# EasyEDA Pro project ProPrj_ZYNQ7020_V1_2024-12-31.epro, board PCB_7020
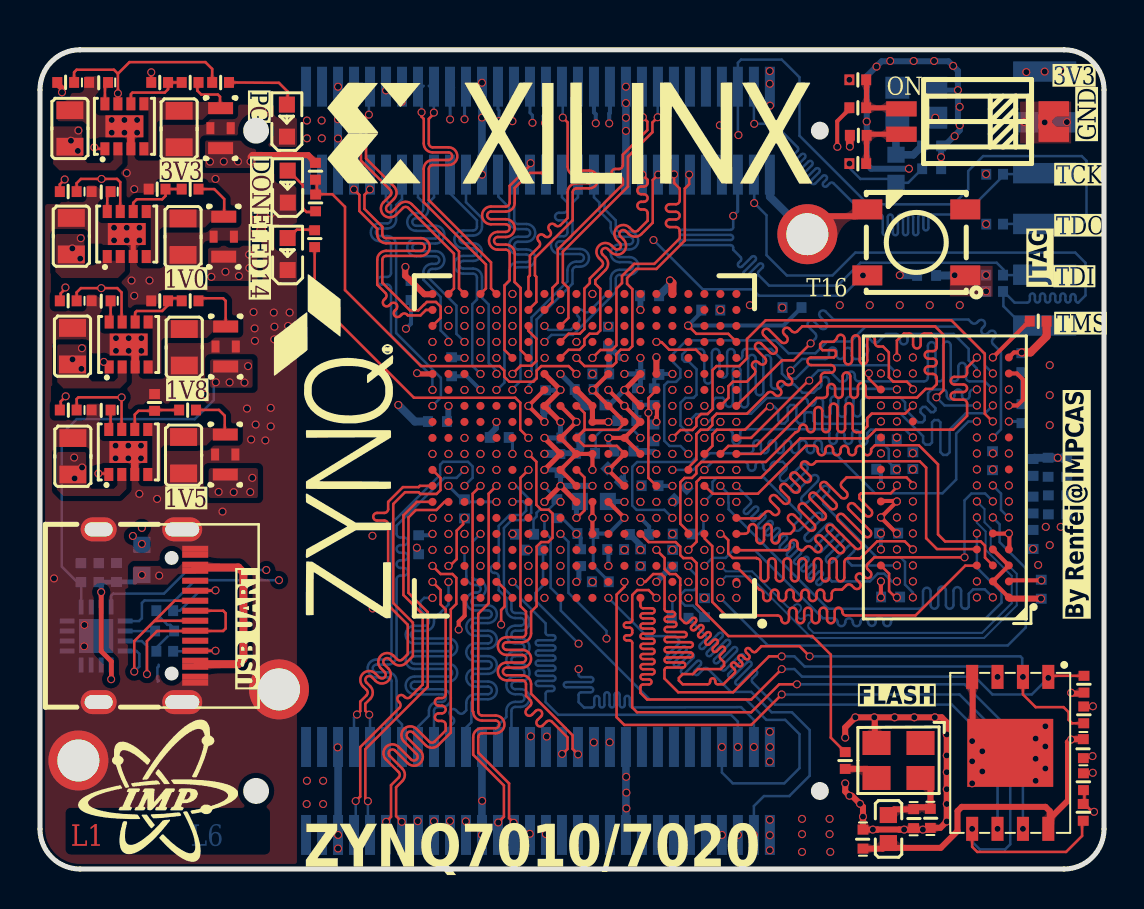
[diagram p5: board, top side]
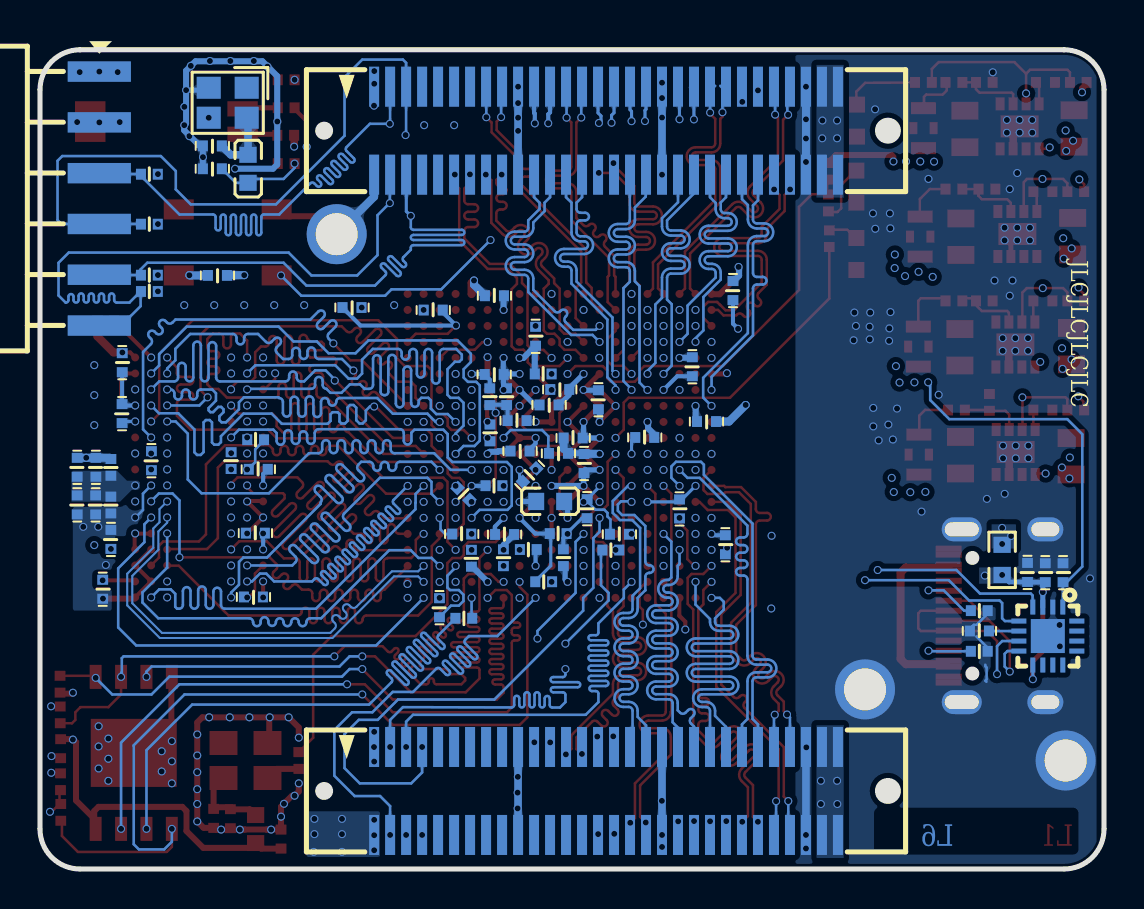
[diagram p6: board, bottom side, seen from below]

Outline 53.22 x 40.97 mm; copper layers: Top Layer, 地1, 电源, 信号, 地2, Bottom Layer. Coordinates in mm from the lower left corner of the outline.
Outline path: 0,38.97 0,2 arc(0.59,0.59) 2,0 51.22,0 arc(52.63,0.59) 53.22,2 53.22,38.97 arc(52.63,40.38) 51.22,40.97 2,40.97 arc(0.59,40.38) 0,38.97
Stack: Top Layer 0.035mm 外层铜厚1oz / Dielectric1 0.0994mm 3313 RC57% 4.2mil / 地1 0.0152mm 内层铜厚 / Dielectric2 0.55mm 0.55mm H/H No copper / 电源 0.0152mm 内层铜厚 / Dielectric3 0.1088mm 2116 RC54% 4.9mil / 信号 0.0152mm 内层铜厚 / Dielectric4 0.55mm 0.55mm H/H No copper / 地2 0.0152mm 内层铜厚 / Dielectric5 0.0994mm 3313 RC57% 4.2mil / Bottom Layer 0.035mm 外层铜厚1oz

## Design rules (mm)
net DDR_DQS0_N: DDR_DQS0_
net DDR_DQS0_P: DDR_DQS0_
net DDR_DQS1_N: DDR_DQS1_
net DDR_DQS1_P: DDR_DQS1_
net DDR_CLK_P: DDR_CLK_
net DDR_CLK_N: DDR_CLK_
net AIO_1_N: AIO_1
net AIO_1_P: AIO_1
net AIO_2_P: AIO_2
net AIO_5_P: AIO_5
net AIO_6_N: AIO_6
net AIO_24_P: AIO_24
net AIO_5_N: AIO_5
net AIO_9_P: AIO_9
net AIO_19_P: AIO_19
net AIO_24_N: AIO_24
net AIO_23_P: AIO_23
net AIO_13_P: AIO_13
net AIO_14_P: AIO_14
net AIO_23_N: AIO_23
net AIO_13_N: AIO_13
net AIO_14_N: AIO_14
net AIO_19_N: AIO_19
net AIO_20_N: AIO_20
net AIO_20_P: AIO_20
net AIO_15_P: AIO_15
net AIO_8_N: AIO_8
net AIO_7_P: AIO_7
net AIO_7_N: AIO_7
net AIO_17_P: DP1
net AIO_17_N: DP1
net AIO_4_N: AIO_4
net AIO_8_P: AIO_8
net AIO_10_N: AIO_10
net AIO_18_N: AIO_18
net AIO_22_P: AIO_22
net AIO_22_N: AIO_22
net AIO_16_N: AIO_16
net AIO_4_P: AIO_4
net AIO_3_N: AIO_3
net AIO_10_P: AIO_10
net AIO_18_P: AIO_18
net AIO_21_P: AIO_21
net AIO_21_N: AIO_21
net AIO_16_P: AIO_16
net AIO_2_N: AIO_2
net AIO_3_P: AIO_3
net AIO_9_N: AIO_9
net AIO_12_P: AIO_12
net AIO_12_N: AIO_12
net AIO_15_N: AIO_15
net AIO_6_P: AIO_6
net BIO_19_N: BIO_19
net BIO_6_P: BIO_6
net BIO_19_P: BIO_19
net BIO_22_N: BIO_22
net BIO_23_N: BIO_23
net BIO_21_P: BIO_21
net BIO_21_N: BIO_21
net BIO_11_P: BIO_11
net BIO_24_P: BIO_24
net BIO_24_N: BIO_24
net BIO_13_P: BIO_13
net BIO_2_N: BIO_2
net BIO_2_P: BIO_2
net BIO_1_N: BIO_1
net BIO_1_P: BIO_1
net BIO_3_N: BIO_3
net BIO_4_P: BIO_4
net BIO_4_N: BIO_4
net BIO_3_P: BIO_3
net BIO_5_P: BIO_5
net BIO_5_N: BIO_5
net BIO_6_N: BIO_6
net BIO_15_P: BIO_15
net BIO_15_N: BIO_15
net BIO_16_P: BIO_16
net BIO_16_N: BIO_16
net BIO_18_P: BIO_18
net BIO_18_N: BIO_18
net BIO_13_N: BIO_13
net BIO_14_N: BIO_14
net BIO_17_N: BIO_17
net BIO_14_P: BIO_14
net BIO_10_N: BIO_10
net BIO_17_P: BIO_17
net BIO_12_P: BIO_12
net BIO_12_N: BIO_12
net BIO_10_P: BIO_10
net BIO_11_N: BIO_11
net BIO_9_P: BIO_9
net BIO_9_N: BIO_9
net BIO_8_P: BIO_8
net BIO_8_N: BIO_8
net BIO_7_P: BIO_7
net BIO_7_N: BIO_7
net BIO_23_P: BIO_23
net BIO_22_P: BIO_22
net BIO_20_P: BIO_20
net BIO_20_N: BIO_20
template: 自定义配置
spacing copperThickness1oz (default): track to track 0.127, other pairs 0.127 to 0.3
spacing copperThickness2oz: track to track 0.203, other pairs 0.152 to 0.3
track width copperThickness1oz (default): min 0.102, default 0.127, max 2.54
track width copperThickness2oz: min 0.203, default 0.254, max 2.54
differential pair differentialPair: width min 0.102, default 0.102, max 2.54; gap min 0.152, default 0.152
differential pair DIFF100 (default): width min 0.102, default 0.102, max 2.54; gap min 0.127, default 0.127
via viaSize (default): diameter min 0.399, default 0.399, max 10; hole min 0.3, default 0.3, max 6.299
net DDR_DQS0_N uses differentialPair
net DDR_DQS0_P uses differentialPair
net DDR_DQS1_N uses differentialPair
net DDR_DQS1_P uses differentialPair
net DDR_CLK_P uses differentialPair
net DDR_CLK_N uses differentialPair
diff pair DDR_DQS0_ uses differentialPair
diff pair DDR_DQS1_ uses differentialPair
diff pair DDR_CLK_ uses differentialPair

## Placement (name value [footprint] x y rotation side)
C1  100nF  [C0402]  29.36 22.42 180 bottom
C2  3.3nF  [C0402]  3.06 33.88 180 top
C3  3.3nF  [C0402]  3.06 28.41 180 top
C5  22uF  [C0805]  1.57 31.63 90 top
C6  22uF  [C0805]  1.63 26.13 90 top
C7  22uF  [C0805]  7.16 31.63 270 top
C8  22uF  [C0805]  7.22 26.11 270 top
C9  3.3nF  [C0402]  2.94 39.34 180 top
C10  3.3nF  [C0402]  3.06 22.95 180 top
C11  22uF  [C0805]  1.5 37.02 90 top
C12  22uF  [C0805]  1.64 20.63 90 top
C13  22uF  [C0805]  6.96 37.02 270 top
C14  22uF  [C0805]  7.18 20.71 270 top
C15  100nF  [C0402]  33.24 13.06 90 bottom
C16  100nF  [C0402]  47.65 20.41 90 bottom
C17  100nF  [C0402]  37.61 28.08 0 bottom
C18  100nF  [C0402]  42.45 16.8 180 bottom
C19  100nF  [C0402]  32.13 16.75 180 bottom
C20  100nF  [C0402]  49.11 22.77 90 bottom
C21  100nF  [C0402]  50.08 14 270 bottom
C22  100nF  [C0402]  42.31 19.99 180 bottom
C23  100nF  [C0402]  30.5 24.73 0 bottom
C24  100nF  [C0402]  49.11 25.33 270 bottom
C25  100nF  [C0402]  49.67 16.48 90 bottom
C26  100nF  [C0402]  42.54 13.6 0 bottom
C30  100nF  [C0402]  33.56 27.95 180 bottom
C36  100nF  [C0402]  50.44 18.2 90 bottom
C37  100nF  [C0402]  50.42 20.08 90 bottom
C42  10nF  [C0402]  51.36 18.2 90 bottom
C43  10nF  [C0402]  51.36 20.08 90 bottom
C44  100nF  [C0402]  44.53 2.54 270 top
C45  10pF  [C0402]  43.7 2.52 270 top
C46  100nF  [C0402]  41.16 1.49 90 top
C47  100nF  [C0402]  52.19 6.01 90 top
C48  100nF  [C0402]  25.86 18.01 90 bottom
C54  100nF  [C0402]  6.24 11.9 180 bottom
C55  2.2uF  [C0402]  3.83 14.83 90 bottom
C56  100nF  [C0402]  2.05 14.83 270 bottom
C57  100nF  [C0402]  2.94 14.83 270 bottom
C58  100nF  [C0402]  18.56 28.92 90 bottom
C59  100nF  [C0402]  19.88 22.38 0 bottom
C60  100nF  [C0402]  18.94 16.22 270 bottom
C61  100nF  [C0402]  29.2 20.9 0 bottom
C62  100nF  [C0402]  21.23 18.01 270 bottom
C63  100nF  [C0402]  20.59 25.11 90 bottom
C64  100nF  [C0402]  28.43 26.65 270 bottom
C65  100nF  [C0402]  30.5 28.67 180 bottom
C66  100nF  [C0402]  29.99 16.73 180 bottom
C67  100nF  [C0402]  22.98 21.58 180 bottom
C68  100nF  [C0402]  25.29 23.46 90 bottom
C69  100nF  [C0402]  26.01 20.28 270 bottom
C70  100nF  [C0402]  27.75 23.21 0 bottom
C71  100nF  [C0402]  26.56 21.56 180 bottom
C73  100nF  [C0402]  27.28 20.79 0 bottom
C74  100nF  [C0402]  28.73 19.7 135 bottom
C75  100nF  [C0402]  24.24 16.74 180 bottom
C76  100nF  [C0402]  27.22 23.98 0 bottom
C80  100nF  [C0402]  44.59 36.16 0 bottom
C81  100nF  [C0402]  44.59 35.02 0 bottom
C82  100nF  [C0402]  44.34 29.68 0 bottom
CN1  X0802WVS-60AS-LPV01  [CONN-SMD_60P-P0.80_XKB_X0802WVS-60ADS-LPV01]  24.91 36.92 180 bottom
CN2  X0802WVS-60AS-LPV01  [CONN-SMD_60P-P0.80_XKB_X0802WVS-60ADS-LPV01]  24.91 3.9 180 bottom
CN3  X6511WRS-06H-C60D48  [HDR-SMD_6P-P2.54-H-M-W13.3-N]  50.25 33.53 270 bottom
L1  NFM21PC104R1E3D  [CAP-SMD_4P-L2.0-W1.25]  9.19 31.62 90 top
L2  NFM21PC104R1E3D  [CAP-SMD_4P-L2.0-W1.25]  9.29 26.13 90 top
L3  BLM18KG121TN1D  [L0603]  27.7 18.38 180 bottom
L4  NFM21PC104R1E3D  [CAP-SMD_4P-L2.0-W1.25]  9.03 37.05 90 top
L5  NFM21PC104R1E3D  [CAP-SMD_4P-L2.0-W1.25]  9.27 20.73 90 top
L6  BLM18KG121TN1D  [L0603]  42.43 2 270 top
L7  BLM18KG121TN1D  [L0603]  42.81 35.02 270 bottom
LED1  YLED0603G  [LED_0603]  12.38 34.18 90 top
LED2  YLED0603G  [LED_0603]  12.35 37.48 90 top
LED3  YLED0603R  [LED_0603]  12.38 30.81 90 top
NOREF  -  [Pad_e6855]  38.38 31.75 0 top
NOREF#2  -  [Pad_e6858]  11.95 8.98 0 top
NOREF#3  -  [Pad_e4014]  1.92 5.43 0 top
R1  4.7kΩ  [R0402]  28.05 24.76 180 bottom
R2  4.7kΩ  [R0402]  30.71 21.81 270 bottom
R3  1kΩ  [R0402]  29.88 23.62 90 bottom
R4  10kΩ  [R0402]  1.41 33.88 0 top
R5  10kΩ  [R0402]  1.41 28.41 0 top
R6  1kΩ  [R0402]  30.72 23.62 270 bottom
R7  100kΩ  [R0402]  5.86 34 180 top
R8  27kΩ  [R0402]  7.51 34 180 top
R9  91kΩ  [R0402]  5.98 28.41 180 top
R10  120kΩ  [R0402]  7.51 28.41 180 top
R11  10kΩ  [R0402]  1.29 39.34 0 top
R12  10kΩ  [R0402]  1.41 22.95 180 top
R13  24kΩ  [R0402]  5.98 39.34 180 top
R14  75kΩ  [R0402]  7.51 39.34 180 top
R15  91kΩ  [R0402]  5.73 23.33 90 top
R16  82kΩ  [R0402]  7.38 22.95 180 top
R18  240Ω  [R0402]  42.43 21.47 180 bottom
R19  80.6Ω  [R0402]  30.51 19.17 0 bottom
R20  80.6Ω  [R0402]  32.04 18.75 225 bottom
R21  4.7kΩ  [R0402]  49.93 27.4 180 top
R22  80.6Ω  [R0402]  43.66 20.42 90 bottom
R25  1kΩ  [R0402]  49.68 18.2 90 bottom
R26  1kΩ  [R0402]  49.68 20.08 90 bottom
R27  20Ω  [R0402]  40.28 5.43 90 top
R28  10kΩ  [R0402_NEW]  31.65 15.54 90 bottom
R29  470Ω  [R0402_NEW]  52.21 9.24 90 top
R30  10kΩ  [R0402_NEW]  52.19 2.84 270 top
R31  10kΩ  [R0402_NEW]  52.21 7.71 270 top
R32  10kΩ  [R0402_NEW]  52.19 4.36 90 top
R33  10kΩ  [R0402_NEW]  28.79 15.97 0 bottom
R34  10kΩ  [R0402]  28.03 14.36 0 bottom
R36  20kΩ  [R0402]  30.04 15.57 270 bottom
R37  1kΩ  [R0402]  27.04 15.57 270 bottom
R38  1kΩ  [R0402]  27.3 16.77 180 bottom
R39  33Ω  [R0402]  32.02 12.54 0 bottom
R40  33Ω  [R0402]  24.67 15.95 0 bottom
R73  20kΩ  [R0402_NEW]  40.91 38.07 180 top
R74  20kΩ  [R0402_NEW]  40.93 36.69 180 top
R75  10kΩ  [R0402_NEW]  40.91 35.27 180 top
R76  10kΩ  [R0402_NEW]  40.91 39.46 180 top
R77  1kΩ  [R0402]  13.78 33.31 90 top
R78  1kΩ  [R0402]  13.78 34.89 270 top
R79  4.7kΩ  [R0402]  6.24 10.89 0 bottom
R80  4.7kΩ  [R0402]  6.24 12.92 0 bottom
R81  2kΩ  [R0402]  9.03 39.34 180 top
R82  1kΩ  [R0402]  13.74 31.52 270 top
R83  0Ω  [R0603]  5.1 15.46 90 bottom
R84  10kΩ  [R0402_NEW]  47.75 28.89 180 bottom
R85  10kΩ  [R0402_NEW]  47.75 29.7 180 bottom
R86  10kΩ  [R0402_NEW]  47.75 32.25 180 bottom
R87  10kΩ  [R0402_NEW]  47.75 34.75 180 bottom
SW1  DSHP02TSGET  [SW-SMD_4P_DSHP02TSGET]  46.9 37.38 90 top
U1  TPS82130SILR  [USIP-8_L3.0-W2.8-P0.65-TL-EP]  4.34 31.75 90 top
U2  TPS82130SILR  [USIP-8_L3.0-W2.8-P0.65-TL-EP]  4.44 26.23 90 top
U3  TPS82130SILR  [USIP-8_L3.0-W2.8-P0.65-TL-EP]  4.22 37.14 90 top
U4  TPS82130SILR  [USIP-8_L3.0-W2.8-P0.65-TL-EP]  4.42 20.86 90 top
U5  MT41K256M16TW-107 IT:P  [FBGA-96_L14.0-W8.0-R16-C6-P0.80-TL]  45.26 19.58 180 top
U7  XC7Z010-1CLG400C  [FBGA-400_L17.0-W17.0-R20-C20-P0.80-TL]  27.23 21.16 180 top
U9  CH343P  [TQFN-16_L3.0-W3.0-P0.50-BL-EP1.7]  2.81 11.65 0 bottom
U10  W25Q128JVEIQ  [WSON-8_L6.0-W8.0-P1.27-BL-EP]  48.53 5.81 180 top
U11  WS2812B-V5  [LED-SMD_4P-L5.0-W5.0-TL_WS2812B-B]  43.83 31.34 180 top
USB1  typec  [USB-C-SMD_KH-TYPE-C-16P]  5.35 12.67 270 top
X1  33.3333MHz  [OSC-SMD_4P-L3.2-W2.5-BL]  42.94 5.43 180 top
X2  50MHz  [OSC-SMD_4P-L2.5-W2.0-BL]  43.83 38.32 0 bottom

## Footprints (pads in the part's own frame, mm; a bottom-side part is the same pattern mirrored in y, then rotated)
C0402
  rect 0.5x0.54 smd: 1(-0.469,0) 2(0.481,0)
C0805
  rect 0.889x1.35 smd: 1(-0.898,0) 2(0.924,0)
CAP-SMD_4P-L2.0-W1.25
  rect 0.6x1.25 smd: 1(-1,0) 3(1,0)
  rect 0.6x0.4 smd: 2(0,-0.508) 4(0,0.508)
CONN-SMD_60P-P0.80_XKB_X0802WVS-60ADS-LPV01
  rect 0.5x2 smd: 1(-11.6,2.2) 2(-11.6,-2.2) 3(-10.8,2.2) 4(-10.8,-2.2) 5(-10,2.2) 6(-10,-2.2) 7(-9.2,2.2) 8(-9.2,-2.2) 9(-8.4,2.2) 10(-8.4,-2.2) 11(-7.6,2.2) 12(-7.6,-2.2) 13(-6.8,2.2) 14(-6.8,-2.2) 15(-6,2.2) 16(-6,-2.2) 17(-5.2,2.2) 18(-5.2,-2.2) 19(-4.4,2.2) 20(-4.4,-2.2) 21(-3.6,2.2) 22(-3.6,-2.2) 23(-2.8,2.2) 24(-2.8,-2.2) 25(-2,2.2) 26(-2,-2.2) 27(-1.2,2.2) 28(-1.2,-2.2) 29(-0.4,2.2) 30(-0.4,-2.2) 31(0.4,2.2) 32(0.4,-2.2) 33(1.2,2.2) 34(1.2,-2.2) 35(2,2.2) 36(2,-2.2) 37(2.8,2.2) 38(2.8,-2.2) 39(3.6,2.2) 40(3.6,-2.2) 41(4.4,2.2) 42(4.4,-2.2) 43(5.2,2.2) 44(5.2,-2.2) 45(6,2.2) 46(6,-2.2) 47(6.8,2.2) 48(6.8,-2.2) 49(7.6,2.2) 50(7.6,-2.2) 51(8.4,2.2) 52(8.4,-2.2) 53(9.2,2.2) 54(9.2,-2.2) 55(10,2.2) 56(10,-2.2) 57(10.8,2.2) 58(10.8,-2.2) 59(11.6,2.2) 60(11.6,-2.2)
FBGA-96_L14.0-W8.0-R16-C6-P0.80-TL
  round 0.394 smd: A1(-3.2,6) A2(-2.4,6) A3(-1.6,6) A7(1.6,6) A8(2.4,6) A9(3.2,6) B1(-3.2,5.2) B2(-2.4,5.2) B3(-1.6,5.2) B7(1.6,5.2) B8(2.4,5.2) B9(3.2,5.2) C1(-3.2,4.4) C2(-2.4,4.4) C3(-1.6,4.4) C7(1.6,4.4) C8(2.4,4.4) C9(3.2,4.4) D1(-3.2,3.6) D2(-2.4,3.6) D3(-1.6,3.6) D7(1.6,3.6) D8(2.4,3.6) D9(3.2,3.6) E1(-3.2,2.8) E2(-2.4,2.8) E3(-1.6,2.8) E7(1.6,2.8) E8(2.4,2.8) E9(3.2,2.8) F1(-3.2,2) F2(-2.4,2) F3(-1.6,2) F7(1.6,2) F8(2.4,2) F9(3.2,2) G1(-3.2,1.2) G2(-2.4,1.2) G3(-1.6,1.2) G7(1.6,1.2) G8(2.4,1.2) G9(3.2,1.2) H1(-3.2,0.4) H2(-2.4,0.4) H3(-1.6,0.4) H7(1.6,0.4) H8(2.4,0.4) H9(3.2,0.4) J1(-3.2,-0.4) J2(-2.4,-0.4) J3(-1.6,-0.4) J7(1.6,-0.4) J8(2.4,-0.4) J9(3.2,-0.4) K1(-3.2,-1.2) K2(-2.4,-1.2) K3(-1.6,-1.2) K7(1.6,-1.2) K8(2.4,-1.2) K9(3.2,-1.2) L1(-3.2,-2) L2(-2.4,-2) L3(-1.6,-2) L7(1.6,-2) L8(2.4,-2) L9(3.2,-2) M1(-3.2,-2.8) M2(-2.4,-2.8) M3(-1.6,-2.8) M7(1.6,-2.8) M8(2.4,-2.8) M9(3.2,-2.8) N1(-3.2,-3.6) N2(-2.4,-3.6) N3(-1.6,-3.6) N7(1.6,-3.6) N8(2.4,-3.6) N9(3.2,-3.6) P1(-3.2,-4.4) P2(-2.4,-4.4) P3(-1.6,-4.4) P7(1.6,-4.4) P8(2.4,-4.4) P9(3.2,-4.4) R1(-3.2,-5.2) R2(-2.4,-5.2) R3(-1.6,-5.2) R7(1.6,-5.2) R8(2.4,-5.2) R9(3.2,-5.2) T1(-3.2,-6) T2(-2.4,-6) T3(-1.6,-6) T7(1.6,-6) T8(2.4,-6) T9(3.2,-6)
FBGA-400_L17.0-W17.0-R20-C20-P0.80-TL
  round 0.4 smd: A1(-7.6,7.6) A2(-6.8,7.6) A3(-6,7.6) A4(-5.2,7.6) A5(-4.4,7.6) A6(-3.6,7.6) A7(-2.8,7.6) A8(-2,7.6) A9(-1.2,7.6) A10(-0.4,7.6) A11(0.4,7.6) A12(1.2,7.6) A13(2,7.6) A14(2.8,7.6) A15(3.6,7.6) A16(4.4,7.6) A17(5.2,7.6) A18(6,7.6) A19(6.8,7.6) A20(7.6,7.6) B1(-7.6,6.8) B2(-6.8,6.8) B3(-6,6.8) B4(-5.2,6.8) B5(-4.4,6.8) B6(-3.6,6.8) B7(-2.8,6.8) B8(-2,6.8) B9(-1.2,6.8) B10(-0.4,6.8) B11(0.4,6.8) B12(1.2,6.8) B13(2,6.8) B14(2.8,6.8) B15(3.6,6.8) B16(4.4,6.8) B17(5.2,6.8) B18(6,6.8) B19(6.8,6.8) B20(7.6,6.8) C1(-7.6,6) C2(-6.8,6) C3(-6,6) C4(-5.2,6) C5(-4.4,6) C6(-3.6,6) C7(-2.8,6) C8(-2,6) C9(-1.2,6) C10(-0.4,6) C11(0.4,6) C12(1.2,6) C13(2,6) C14(2.8,6) C15(3.6,6) C16(4.4,6) C17(5.2,6) C18(6,6) C19(6.8,6) C20(7.6,6) D1(-7.6,5.2) D2(-6.8,5.2) D3(-6,5.2) D4(-5.2,5.2) D5(-4.4,5.2) D6(-3.6,5.2) D7(-2.8,5.2) D8(-2,5.2) D9(-1.2,5.2) D10(-0.4,5.2) D11(0.4,5.2) D12(1.2,5.2) D13(2,5.2) D14(2.8,5.2) D15(3.6,5.2) D16(4.4,5.2) D17(5.2,5.2) D18(6,5.2) D19(6.8,5.2) D20(7.6,5.2) E1(-7.6,4.4) E2(-6.8,4.4) E3(-6,4.4) E4(-5.2,4.4) E5(-4.4,4.4) E6(-3.6,4.4) E7(-2.8,4.4) E8(-2,4.4) E9(-1.2,4.4) E10(-0.4,4.4) E11(0.4,4.4) E12(1.2,4.4) E13(2,4.4) E14(2.8,4.4) E15(3.6,4.4) E16(4.4,4.4) E17(5.2,4.4) E18(6,4.4) E19(6.8,4.4) E20(7.6,4.4) F1(-7.6,3.6) F2(-6.8,3.6) F3(-6,3.6) F4(-5.2,3.6) F5(-4.4,3.6) F6(-3.6,3.6) F7(-2.8,3.6) F8(-2,3.6) F9(-1.2,3.6) F10(-0.4,3.6) F11(0.4,3.6) F12(1.2,3.6) F13(2,3.6) F14(2.8,3.6) F15(3.6,3.6) F16(4.4,3.6) F17(5.2,3.6) F18(6,3.6) F19(6.8,3.6) F20(7.6,3.6) G1(-7.6,2.8) G2(-6.8,2.8) G3(-6,2.8) G4(-5.2,2.8) G5(-4.4,2.8) G6(-3.6,2.8) G7(-2.8,2.8) G8(-2,2.8) G9(-1.2,2.8) G10(-0.4,2.8) G11(0.4,2.8) G12(1.2,2.8) G13(2,2.8) G14(2.8,2.8) G15(3.6,2.8) G16(4.4,2.8) G17(5.2,2.8) G18(6,2.8) G19(6.8,2.8) G20(7.6,2.8) H1(-7.6,2) H2(-6.8,2) H3(-6,2) H4(-5.2,2) H5(-4.4,2) H6(-3.6,2) H7(-2.8,2) H8(-2,2) H9(-1.2,2) H10(-0.4,2) H11(0.4,2) H12(1.2,2) H13(2,2) H14(2.8,2) H15(3.6,2) H16(4.4,2) H17(5.2,2) H18(6,2) H19(6.8,2) H20(7.6,2) J1(-7.6,1.2) J2(-6.8,1.2) J3(-6,1.2) J4(-5.2,1.2) J5(-4.4,1.2) J6(-3.6,1.2) J7(-2.8,1.2) J8(-2,1.2) J9(-1.2,1.2) J10(-0.4,1.2) J11(0.4,1.2) J12(1.2,1.2) J13(2,1.2) J14(2.8,1.2) J15(3.6,1.2) J16(4.4,1.2) J17(5.2,1.2) J18(6,1.2) J19(6.8,1.2) J20(7.6,1.2) K1(-7.6,0.4) K2(-6.8,0.4) K3(-6,0.4) K4(-5.2,0.4) K5(-4.4,0.4) K6(-3.6,0.4) K7(-2.8,0.4) K8(-2,0.4) K9(-1.2,0.4) K10(-0.4,0.4) K11(0.4,0.4) K12(1.2,0.4) K13(2,0.4) K14(2.8,0.4) K15(3.6,0.4) K16(4.4,0.4) K17(5.2,0.4) K18(6,0.4) K19(6.8,0.4) K20(7.6,0.4) L1(-7.6,-0.4) L2(-6.8,-0.4) L3(-6,-0.4) L4(-5.2,-0.4) L5(-4.4,-0.4) L6(-3.6,-0.4) L7(-2.8,-0.4) L8(-2,-0.4) L9(-1.2,-0.4) L10(-0.4,-0.4) L11(0.4,-0.4) L12(1.2,-0.4) L13(2,-0.4) L14(2.8,-0.4) L15(3.6,-0.4) L16(4.4,-0.4) L17(5.2,-0.4) L18(6,-0.4) L19(6.8,-0.4) L20(7.6,-0.4) M1(-7.6,-1.2) M2(-6.8,-1.2) M3(-6,-1.2) M4(-5.2,-1.2) M5(-4.4,-1.2) M6(-3.6,-1.2) M7(-2.8,-1.2) M8(-2,-1.2) M9(-1.2,-1.2) M10(-0.4,-1.2) M11(0.4,-1.2) M12(1.2,-1.2) M13(2,-1.2) M14(2.8,-1.2) M15(3.6,-1.2) M16(4.4,-1.2) M17(5.2,-1.2) M18(6,-1.2) M19(6.8,-1.2) M20(7.6,-1.2) N1(-7.6,-2) N2(-6.8,-2) N3(-6,-2) N4(-5.2,-2) N5(-4.4,-2) N6(-3.6,-2) N7(-2.8,-2) N8(-2,-2) N9(-1.2,-2) N10(-0.4,-2) N11(0.4,-2) N12(1.2,-2) N13(2,-2) N14(2.8,-2) N15(3.6,-2) N16(4.4,-2) N17(5.2,-2) N18(6,-2) N19(6.8,-2) N20(7.6,-2) P1(-7.6,-2.8) P2(-6.8,-2.8) P3(-6,-2.8) P4(-5.2,-2.8) P5(-4.4,-2.8) P6(-3.6,-2.8) P7(-2.8,-2.8) P8(-2,-2.8) P9(-1.2,-2.8) P10(-0.4,-2.8) P11(0.4,-2.8) P12(1.2,-2.8) P13(2,-2.8) P14(2.8,-2.8) P15(3.6,-2.8) P16(4.4,-2.8) P17(5.2,-2.8) P18(6,-2.8) P19(6.8,-2.8) P20(7.6,-2.8) R1(-7.6,-3.6) R2(-6.8,-3.6) R3(-6,-3.6) R4(-5.2,-3.6) R5(-4.4,-3.6) R6(-3.6,-3.6) R7(-2.8,-3.6) R8(-2,-3.6) R9(-1.2,-3.6) R10(-0.4,-3.6) R11(0.4,-3.6) R12(1.2,-3.6) R13(2,-3.6) R14(2.8,-3.6) R15(3.6,-3.6) R16(4.4,-3.6) R17(5.2,-3.6) R18(6,-3.6) R19(6.8,-3.6) R20(7.6,-3.6) T1(-7.6,-4.4) T2(-6.8,-4.4) T3(-6,-4.4) T4(-5.2,-4.4) T5(-4.4,-4.4) T6(-3.6,-4.4) T7(-2.8,-4.4) T8(-2,-4.4) T9(-1.2,-4.4) T10(-0.4,-4.4) T11(0.4,-4.4) T12(1.2,-4.4) T13(2,-4.4) T14(2.8,-4.4) T15(3.6,-4.4) T16(4.4,-4.4) T17(5.2,-4.4) T18(6,-4.4) T19(6.8,-4.4) T20(7.6,-4.4) U1(-7.6,-5.2) U2(-6.8,-5.2) U3(-6,-5.2) U4(-5.2,-5.2) U5(-4.4,-5.2) U6(-3.6,-5.2) U7(-2.8,-5.2) U8(-2,-5.2) U9(-1.2,-5.2) U10(-0.4,-5.2) U11(0.4,-5.2) U12(1.2,-5.2) U13(2,-5.2) U14(2.8,-5.2) U15(3.6,-5.2) U16(4.4,-5.2) U17(5.2,-5.2) U18(6,-5.2) U19(6.8,-5.2) U20(7.6,-5.2) V1(-7.6,-6) V2(-6.8,-6) V3(-6,-6) V4(-5.2,-6) V5(-4.4,-6) V6(-3.6,-6) V7(-2.8,-6) V8(-2,-6) V9(-1.2,-6) V10(-0.4,-6) V11(0.4,-6) V12(1.2,-6) V13(2,-6) V14(2.8,-6) V15(3.6,-6) V16(4.4,-6) V17(5.2,-6) V18(6,-6) V19(6.8,-6) V20(7.6,-6) W1(-7.6,-6.8) W2(-6.8,-6.8) W3(-6,-6.8) W4(-5.2,-6.8) W5(-4.4,-6.8) W6(-3.6,-6.8) W7(-2.8,-6.8) W8(-2,-6.8) W9(-1.2,-6.8) W10(-0.4,-6.8) W11(0.4,-6.8) W12(1.2,-6.8) W13(2,-6.8) W14(2.8,-6.8) W15(3.6,-6.8) W16(4.4,-6.8) W17(5.2,-6.8) W18(6,-6.8) W19(6.8,-6.8) W20(7.6,-6.8) Y1(-7.6,-7.6) Y2(-6.8,-7.6) Y3(-6,-7.6) Y4(-5.2,-7.6) Y5(-4.4,-7.6) Y6(-3.6,-7.6) Y7(-2.8,-7.6) Y8(-2,-7.6) Y9(-1.2,-7.6) Y10(-0.4,-7.6) Y11(0.4,-7.6) Y12(1.2,-7.6) Y13(2,-7.6) Y14(2.8,-7.6) Y15(3.6,-7.6) Y16(4.4,-7.6) Y17(5.2,-7.6) Y18(6,-7.6) Y19(6.8,-7.6) Y20(7.6,-7.6)
HDR-SMD_6P-P2.54-H-M-W13.3-N
  rect 1.02x3.16 smd: 1(-6.35,0) 2(-3.81,0) 3(-1.27,0) 4(1.27,0) 5(3.81,0) 6(6.35,0)
L0603
  rect 0.8x0.864 smd: 1(-0.7,0) 2(0.7,0)
LED-SMD_4P-L5.0-W5.0-TL_WS2812B-B
  rect 1.5x1 smd: 1(-2.45,1.65) 2(-2.45,-1.65) 3(2.45,-1.65) 4(2.45,1.65)
LED_0603
  rect 0.8x0.8 smd: 1(-0.851,-0.01) 2(0.75,-0.005)
OSC-SMD_4P-L2.5-W2.0-BL
  rect 1.2x1.1 smd: 1(-0.95,-0.75) 2(0.95,-0.75) 3(0.95,0.75) 4(-0.95,0.75)
OSC-SMD_4P-L3.2-W2.5-BL
  rect 1.4x1.2 smd: 1(-1.1,-0.875) 2(1.1,-0.875) 3(1.1,0.875) 4(-1.1,0.875)
Pad_e4014
  round 3 hole 2.1: 1(0,0)
Pad_e6855
  round 3 hole 2.1: 1(0,0)
Pad_e6858
  round 3 hole 2.1: 1(0,0)
R0402
  rect 0.5x0.54 smd: 1(-0.42,0) 2(0.42,0)
R0402_NEW
  rect 0.5x0.54 smd: 1(-0.415,-0.005) 2(0.424,-0.005)
R0603
  rect 0.806x0.864 smd: 1(-0.753,0) 2(0.753,0)
SW-SMD_4P_DSHP02TSGET
  rect 0.762x1.524 smd: 1(-0.635,-3.81) 2(0.635,-3.81) 3(0.635,3.81) 4(-0.635,3.81)
TQFN-16_L3.0-W3.0-P0.50-BL-EP1.7
  rect 0.25x0.75 smd: 1(-0.749,-1.45) 2(-0.248,-1.45) 3(0.252,-1.45) 4(0.751,-1.45) 9(0.75,1.45) 10(0.25,1.45) 11(-0.25,1.45) 12(-0.749,1.45)
  rect 0.75x0.25 smd: 5(1.45,-0.75) 6(1.45,-0.25) 7(1.45,0.25) 8(1.45,0.75) 13(-1.45,0.75) 14(-1.45,0.25) 15(-1.45,-0.25) 16(-1.45,-0.75)
  rect 1.7x1.7 smd: 17(0.001,0)
USB-C-SMD_KH-TYPE-C-16P
  oval 1.2x2 hole 0.7x1.7: 1(-4.32,1.765) 2(4.32,1.765)
  oval 1.2x1.8 hole 0.7x1.4: 3(-4.32,-2.415) 4(4.32,-2.415)
  rect 0.3x1.3 smd: A1(-3.35,2.415) A4(-2.55,2.415) A5(-1.25,2.415) A6(-0.25,2.415) A7(0.25,2.415) A8(1.25,2.415) A9(2.55,2.415) A12(3.35,2.415) B1(3.05,2.415) B4(2.25,2.415) B5(1.75,2.415) B6(0.75,2.415) B7(-0.75,2.415) B8(-1.75,2.415) B9(-2.25,2.415) B12(-3.05,2.415)
USIP-8_L3.0-W2.8-P0.65-TL-EP
  rect 0.65x0.45 smd: 1(-1.125,0.975) 2(-1.125,0.325) 3(-1.125,-0.325) 4(-1.125,-0.975) 5(1.125,-0.975) 6(1.125,-0.325) 7(1.125,0.325) 8(1.125,0.975)
  rect 1.1x1.9 smd: 9(0,0)
WSON-8_L6.0-W8.0-P1.27-BL-EP
  rect 0.6x1.2 smd: 1(-1.905,-3.8) 2(-0.635,-3.8) 3(0.635,-3.8) 4(1.905,-3.8) 5(1.905,3.8) 6(0.635,3.8) 7(-0.635,3.8) 8(-1.905,3.8)
  rect 4.3x3.4 smd: 9(0.001,0.001)

## Nets
As in the schematic, except:
GND: C1.2 C2.2 C3.2 C5.2 C6.2 C7.2 C8.2 C9.2 C10.2 C11.2 C12.2 C13.2 C14.2 C15.1 C16.1 C17.1 C18.1 C19.1 C20.1 C21.1 C22.1 C23.1 C24.1 C25.1 C26.1 C30.1 C37.2 C43.2 C44.2 C45.2 C46.2 C47.1 C48.2 C54.1 C55.2 C56.1 C57.1 C58.1 C59.1 C60.1 C61.1 C62.1 C63.1 C64.1 C65.1 C66.1 C67.1 C68.1 C69.1 C70.1 C71.1 C73.1 C74.1 C75.1 C76.1 C80.2 C81.2 C82.1 CN1.1 CN1.2 CN1.19 CN1.20 CN1.37 CN1.38 CN1.55 CN1.56 CN2.1 CN2.2 CN2.19 CN2.20 CN2.37 CN2.38 CN2.55 CN2.56 CN3.2 L1.2 L1.4 L2.2 L2.4 L4.2 L4.4 L5.2 L5.4 LED1.1 LED2.1 LED3.1 NOREF.1 NOREF#2.1 NOREF#3.1 R3.2 R7.2 R9.2 R13.2 R15.2 R18.2 R19.1 R21.1 R26.2 R30.1 R31.1 R32.1 R33.1 R37.2 R79.1 R80.1 SW1.1 SW1.2 U1.3 U1.9 U2.3 U2.9 U3.3 U3.9 U4.3 U4.9 U5.A9 U5.B1 U5.B3 U5.B9 U5.D1 U5.D8 U5.E1 U5.E2 U5.E8 U5.F9 U5.G1 U5.G8 U5.G9 U5.J2 U5.J8 U5.M1 U5.M9 U5.P1 U5.P9 U5.T1 U5.T9 U7.A8 U7.A18 U7.B1 U7.B11 U7.C4 U7.C9 U7.C14 U7.D17 U7.E10 U7.E20 U7.F3 U7.F7 U7.F10 U7.G10 U7.G12 U7.G16 U7.H7 U7.H9 U7.H11 U7.H13 U7.H19 U7.J2 U7.J8 U7.J10 U7.J12 U7.K5 U7.K7 U7.K10 U7.K11 U7.K13 U7.K15 U7.L8 U7.L9 U7.L12 U7.L18 U7.M1 U7.M7 U7.M9 U7.M10 U7.M11 U7.M13 U7.N4 U7.N8 U7.N10 U7.N12 U7.N14 U7.P7 U7.P9 U7.P11 U7.P13 U7.P17 U7.R8 U7.R12 U7.R20 U7.T3 U7.T7 U7.T13 U7.U6 U7.U16 U7.V9 U7.V19 U7.W2 U7.W12 U7.Y5 U7.Y15 U9.2 U9.17 U10.4 U10.9 U11.3 USB1.1 USB1.2 USB1.3 USB1.4 USB1.A1 USB1.A12 USB1.B1 USB1.B12 X1.2 X2.2

Pads without a net: CN1 7 8 9 10 11 13; CN2 9 10 11 12 13 14 15 16 17 18 22 24 26 28; U5 J1 J9 L1 L9 M7; U7 A10 A11 A12 A14 B5 B9 B13 C5 C6 C8 C10 C11 C13 C15 C16 C18 D9 D15 D16 E6 E8 E9 E13 E16 F12 K9 L10 P1 P3 R1 R2 R3 T1 T2 T4 T5 T9 U2 U3 U4 U5 U7 U8 U9 U10 V1 V2 V3 V5 V6 V7 V8 V10 V11 W1 W3 W4 W5 W6 W8 W9 W10 W11 Y1 Y2 Y3 Y4 Y6 Y7 Y8 Y9 Y11 Y12 Y13; U9 10 11 12 13 14 15 16; U11 2; USB1 A8 B8; X1 1; X2 1

## Via types
v1: diameter 0.4, hole 0.3, Top Layer to Bottom Layer, 619 vias

## Routing (per net, layer and track width the routed paths; a pad name or vN(x,y) marks a point on that pad's centre or on a via; arc(x,y) is an arc through that point)
1V0: length 27.7
  Top Layer w0.254: U7.R7 v1(29.23,23.96) U7.N7 ; v1(25.23,21.56) U7.K12 v1(25.23,19.96) ; v1(26.03,22.36) U7.N13 v1(26.03,23.96) U7.R13 ; v1(25.23,18.36) v1(26.03,19.16) U7.G11
  电源 w0.127: 29.99,18.36 29.85,18.5 29.85,18.7 29.63,18.92 29.63,19.5 29.85,19.72 29.85,19.88 29.94,19.97 ; 25.2,22.89 24.89,22.58 24.89,22.57 24.84,22.52 24.84,22.2 24.89,22.15 24.89,21.92 ; 24.89,20.25 24.89,20.55 24.84,20.6 24.84,20.92 24.89,20.97 24.89,21.24 ; 24.89,18.63 24.89,18.95 24.84,19 24.84,19.32 24.89,19.37 24.89,19.61 24.93,19.65 ; 21.64,15.54 21.64,16.97 22.08,17.42
  Bottom Layer w0.127: v1(30.03,21.56) 30.03,21.59 29.68,21.95 28.1,21.95 27.8,21.64 27.8,20.8
  Bottom Layer w0.254: v1(29.23,23.96) 28.48,23.21 C70.2 ; v1(26.03,22.36) 26.03,21.6 C71.2 25.24,21.56 v1(25.23,21.56) ; v1(25.23,19.96) 25.92,19.96 25.95,19.99 ; C68.2 26.02,23.94 v1(26.03,23.96) ; v1(26.03,19.16) 26.03,19.89 25.96,19.96
  Bottom Layer w0.3: v1(27.63,19.16) v1(26.03,19.16)
  vias: v1(8.57,29.61) v1(9.28,29.87) v1(9.95,29.65) v1(10.46,30.73) v1(10.47,30.05) v1(16.63,16.67) v1(16.64,13.03) v1(30.03,19.96) v1(30.03,18.36)
1V5: length 79.7
  Top Layer w0.127: v1(42.86,13.58) 42.79,13.58 42.47,13.9 42.47,14.77 U5.C9 ; U7.U1 34.43,26.76 32.83,26.76 v1(32.41,27.18)
  Top Layer w0.2: 48.43,13.61 U5.B2 48.46,15.18 U5.D2 ; 48.46,24.78 48.86,24.78 49.16,24.48 49.16,23.46 48.88,23.18 v1(48.46,23.18)
  Top Layer w0.3: 48.43,13.61 48.46,13.58 48.51,13.53 ; 50.09,13.52 48.5,13.52
  电源 w0.127: 44.12,20.31 44.04,20.39 43.25,20.39 ; 33.69,19.61 33.74,19.57 34.44,19.57 ; 32.06,16.44 32.01,16.4 32.01,16.13 32.02,16.12 32.02,13.4 32.01,13.39 32.01,13.19 ; 34.4,14.75 34.4,14.74 34.4,14.54 34.42,14.52 34.42,13.4 34.4,13.38 34.4,13.18 ; 43.26,22.78 42.51,22.78 42.51,22.79 ; 46.48,21.98 48.03,21.98 48.04,21.97 ; 34.43,22.75 34.4,22.72 34.4,22.55 34.42,22.52 34.42,22.2 34.4,22.17 34.4,21.97 ; 34.38,18.79 34.21,18.79 34.19,18.77 33.87,18.77 33.85,18.79 33.64,18.79 ; 48.88,18.77 48.85,18.8 48.63,18.8 48.62,18.79 48.3,18.79 48.29,18.8 48.1,18.8 ; 46.45,18.77 46.69,18.77 46.7,18.77 47.18,18.77 47.23,18.72 ; 33.62,13.73 33.62,15.58 33.66,15.61 ; 44.08,13.96 44.06,13.98 41.67,13.98 ; 46.46,17.98 48.08,17.98 48.08,17.97 ; 48.08,24.38 48.07,24.38 46.45,24.38 ; 46.46,17.19 47.24,17.19 47.24,17.18 ; 44.07,16.36 44.05,16.39 42.47,16.39 ; 48.05,22.76 48.02,22.79 47.82,22.79 47.82,22.79 46.7,22.79 46.69,22.79 46.49,22.79 ; 42.46,24.38 42.47,24.38 44.04,24.38 ; 34.52,19.53 34.65,19.53 34.67,19.55 34.99,19.55 35.02,19.53 35.24,19.53 ; 33.42,18.95 33.62,18.75 33.62,17.4 33.61,17.38 33.61,17.2 ; 32.83,18.79 32.85,18.77 32.85,18.53 32.84,18.52 32.84,17.4 32.85,17.39 32.85,17.15 ; 44.08,15.57 44.06,15.59 42.46,15.59 ; 32.82,24.35 32.06,24.35 ; 33.62,21.99 33.64,22.02 33.64,22.2 33.64,22.2 33.64,22.52 33.64,22.52 33.64,22.74 ; 46.45,20.4 46.69,20.4 46.7,20.39 47.02,20.39 47.03,20.4 47.21,20.4 47.25,20.36 ; 32.8,21.92 32.8,22.17 32.82,22.2 32.82,23.32 32.8,23.35 32.8,23.47 32.88,23.55 ; 42.44,21.97 42.44,22.21 42.45,22.22 42.45,22.54 42.44,22.55 42.44,22.76 42.43,22.77 ; 44.06,25.17 44.03,25.2 43.83,25.2 43.82,25.19 42.7,25.19 42.69,25.2 42.47,25.2 ; 34.47,18.69 34.42,18.74 ; 44.03,19.57 44.03,19.57 43.82,19.57 43.82,19.57 42.7,19.57 42.7,19.57 42.46,19.57 ; 32.82,13.95 32.82,14.19 32.82,14.2 32.82,16.12 32.82,16.13 32.82,16.5 32.83,16.51 ; 44.08,23.57 44.07,23.58 42.54,23.58 ; 42.45,18.78 42.46,18.77 42.7,18.77 42.7,18.77 43.02,18.77 43.02,18.77 43.26,18.77 ; 34.44,18.75 34.44,19.56 ; 48.07,25.16 48.06,25.18 46.52,25.18 ; 48.04,23.6 47.83,23.6 47.82,23.59 46.7,23.59 46.69,23.6 46.53,23.6 46.48,23.55 ; 44.05,17.15 43.85,17.15 43.82,17.17 42.7,17.17 42.67,17.15 42.55,17.15 42.5,17.2 ; 42.46,14.79 44.07,14.79 44.1,14.76 ; 47.22,21.18 46.52,21.18 46.51,21.19 ; 42.44,17.98 42.45,17.99 43.24,17.99
  Bottom Layer w0.127: v1(47.66,19.18) 48.07,18.77 48.07,17.95 48.44,17.58 v1(48.46,17.58)
  Bottom Layer w0.2: v1(48.46,23.18) 49.05,23.18 C20.2 49.11,24.84 C24.2 ; C22.2 42.06,19.76 v1(42.06,19.18) ; v1(42.06,15.98) v1(42.06,16.78) ; C17.2 37.19,27.18 v1(32.41,27.18) 33.08,27.84 33.08,27.95 ; v1(31.63,24.76) 31.01,24.76 C23.2 30.72,24.48 30.72,24.04
  vias: v1(8.94,18.86) v1(9.69,18.84) v1(10.52,18.85) v1(10.62,19.56) v1(31.63,16.76) v1(32.43,19.16) v1(33.23,21.56) v1(33.23,13.56) v1(34.03,23.96) v1(34.03,15.96) v1(34.83,18.36) v1(42.06,24.78) v1(42.06,23.18) v1(42.86,20.78) v1(43.66,18.38) v1(47.66,20.78) v1(49.93,15.21) v1(50.07,13.52) v1(50.31,17.11) v1(51.06,17.11)
1V8: length 58.4
  Top Layer w0.127: 26.87,17.57 27.23,17.93 27.23,19.59 26.81,20.01 ; 29.28,22.34 28.91,21.96 27.24,21.96 27.24,21.97 27.24,22.8 26.85,23.19 ; 29.19,20.82 28.85,21.16 27.22,21.16 26.88,21.5 ; v1(23.07,12.22) 23.07,12.96 23.24,13.13 23.24,14.01 22.88,14.37
  Top Layer w0.152: 27.22,21.95 27.24,21.96 ; 27.22,21.95 27.22,21.95 U7.L11
  Top Layer w0.203: 28.48,19.92 28.48,19.9 29.17,19.21 ; U7.K8 v1(28.43,19.96) ; U7.M8 U7.N9 v1(27.63,23.96) U7.R9 ; U7.G9 v1(29.23,17.56)
  电源 w0.127: 23.97,15.54 24,15.58 24.26,15.58 24.27,15.57 24.59,15.57 24.6,15.58 24.91,15.58 ; 24.84,14.73 24.79,14.78 24.6,14.78 24.59,14.77 24.27,14.77 24.26,14.78 23.89,14.78 ; 27.98,19.5 28.06,19.42 28.06,19.34 28.04,19.32 28.04,19 28.06,18.98 28.06,18.71 ; 29.61,17.87 29.7,17.97 30.19,17.97 30.44,18.22 30.44,21.99 29.62,22.81 29.62,24.92 29.39,25.15 28.82,25.15 v1(27.63,23.96) ; 27.18,14.73 27.21,14.7 27.21,14.54 27.22,14.52 27.22,14.2 27.21,14.18 27.21,13.87 ; 25.6,14.74 25.86,14.74 25.87,14.75 26.19,14.75 26.2,14.74 26.5,14.74 26.54,14.77 ; 26.45,17.12 26.42,17.09 26.42,16.92 26.42,16.92 26.42,16.6 26.42,16.6 26.42,16.26
  Bottom Layer w0.127: U9.1 2.06,14.33 ; v1(8.8,24.34) 8.69,24.24 8.69,23.45 7.74,22.5 1.84,22.5 1.09,21.75 1.09,15.12 1.95,14.26 2,14.26
  Bottom Layer w0.152: 27.71,16.68 27.67,16.64 27.67,15.16 28.49,14.35
  Bottom Layer w0.203: v1(29.23,17.56) 28.45,16.77 R38.1
  Bottom Layer w0.254: L3.2 26.83,18.21 v1(26.83,17.56)
  vias: v1(9.48,24.34) v1(10.23,24.33) v1(10.41,25.15) v1(23.63,16.76) v1(25.23,13.56) v1(26.03,15.96)
3V3: length 91.2
  Top Layer w0.127: v1(23.63,24.76) 24.04,25.17 24.59,25.17 24.82,25.4 24.82,26.52 24.43,26.91 U7.V14 ; 20.49,15.14 20.84,15.5 20.84,16.92 21.16,17.24 21.16,17.57
  Top Layer w0.2: v1(30.83,22.36) 30.83,22.61 30.86,22.64 30.86,22.99 30.85,22.99 30.85,23.12
  Top Layer w0.3: 10.53,35.62 10.63,35.71 13.42,35.7 13.8,35.32 ; 51.55,6.49 52.21,6.49 52.22,6.51 ; 18.27,30.14 18.27,29.66 18.55,29.41 19.22,28.74 19.65,28.74 ; 51.55,6.48 51.41,6.34 ; 42.19,1.06 L6.2 ; 42.19,1.06 42.16,1.02 C46.1 ; 42.19,1.06 45.05,1.06 45.89,1.9 45.89,2.9 46.11,3.11 50.29,3.11 50.51,2.9 50.51,2.6 ; 50.46,2.47 50.49,2.5 ; 50.45,2.08 50.45,2.47 ; 50.55,2.56 51.42,3.43 51.42,6.34 ; 51.6,8.83 51.65,8.77 52.22,8.77 ; U7.R6 v1(30.83,25.6)
  电源 w0.127: 17.91,26.48 17.88,26.51 17.88,27.41 ; 23.22,25.95 23.19,25.98 23.01,25.98 22.99,25.97 21.87,25.97 21.86,25.98 21.62,25.98 ; 31.22,15.61 31.22,16.31 31.02,16.52 ; 29.45,25.57 29.48,25.57 29.64,25.4 29.64,25.4 29.87,25.17 29.87,25.17 30.07,24.98 ; 19.17,25.3 19.38,25.1 19.38,25.08 ; 21.66,24.38 21.71,24.33 21.85,24.33 21.87,24.35 22.99,24.35 23.01,24.33 23.25,24.33 ; 24.79,24.37 24.78,24.36 24.02,24.36 ; 24.03,20.35 24.03,21.11 24.06,21.15 ; 20.04,17.16 20.04,18.09 20.02,18.12 ; 20.04,17.16 20.04,15.8 20.42,15.42 20.42,15.15 ; 20.04,17.16 20.78,17.16 ; 20.04,17.16 19.27,17.16 ; 25.59,25.97 24.83,25.97 24.82,25.96 ; 19.97,26.82 20.03,26.77 20.03,25.99 ; 21.68,19.54 21.68,19.55 21.61,19.55 ; 21.68,19.54 21.61,19.55 ; 21.68,19.54 21.84,19.52 21.87,19.55 22.99,19.55 23.02,19.52 23.22,19.52 23.23,19.53 ; 21.68,19.54 21.7,19.53 ; 23.23,21.17 23.22,21.16 23.22,20.93 23.22,20.92 23.22,20.6 23.22,20.59 23.22,20.33 ; 24.05,23.56 24.05,23.79 24.04,23.8 24.04,24.12 24.05,24.13 24.05,24.31 24,24.35 ; 31.23,21.2 31.23,21.99 31.18,22.04 ; 24.8,26.75 24.81,26.76 25.62,26.76 ; 21.61,21.16 21.61,20.93 21.62,20.92 21.62,20.6 21.61,20.59 21.61,20.41 21.68,20.34 21.68,20.26 ; 21.61,19.55 20.03,19.55 ; 31.24,17.18 31.24,17.72 31.47,17.95 31.78,17.95 32.02,18.2 32.02,23.32 32.01,23.34 32.01,23.48 31.91,23.57 31.8,23.57 31.79,23.57 31.47,23.57 31.47,23.57 31.25,23.57 ; 31.21,17.74 31.21,18.18 31.22,18.2 31.22,20.12 31.21,20.14 31.21,20.38 ; 24.14,27.55 24.11,27.57 23.8,27.57 23.79,27.57 20.27,27.57 20.27,27.57 19.92,27.57 ; 21.56,25.17 23.2,25.17 23.22,25.15 ; 24.78,24.31 24.78,24.16 24.82,24.12 24.82,23 24.78,22.96 24.78,22.9 24.44,22.56 ; 21.57,18.67 21.66,18.77 23.79,18.77 23.91,18.88 24.2,18.88 ; 22.43,20.34 22.43,21.13 22.46,21.17 ; 31.23,17.19 30.92,16.87
  电源 w0.3: 18.78,16.93 18.77,16.92 18.77,16.04
  Bottom Layer w0.127: C81.1 43.42,34.32 42.81,34.32 42.62,34.51 41.04,34.51 40.49,35.06 v1(40.49,35.28)
  Bottom Layer w0.3: 22.81,22.4 22.81,22.04 22.44,21.67 ; C66.2 30.03,16.2 v1(30.03,15.96) ; 18.86,16.05 18.86,15.8 18.94,15.73 ; v1(30.83,14.36) 31.59,15.12 R28.1 ; 28.47,26.13 29.04,25.56 v1(29.23,25.56) ; 28.47,26.13 R1.1 ; 28.47,26.13 C64.2 ; 20.42,23.14 20.42,22.47 20.33,22.38 ; 44.75,29.7 44.78,29.7 ; 18.54,29.39 18.25,29.68 18.25,30.12 ; 21.19,25.57 20.6,25.57 ; C65.2 30.03,28.65 v1(30.03,27.96) ; C61.2 30.29,20.9 30.33,20.86 30.73,20.86 v1(30.83,20.76)
  Bottom Layer w0.4: v1(45.75,29.7) 45.74,29.68 C82.2
  vias: v1(8.5,35.37) v1(9.19,35.38) v1(9.9,35.39) v1(10.53,35.38) v1(18.28,30.11) v1(18.85,16.07) v1(19.63,20.76) v1(20.43,23.16) v1(20.43,15.16) v1(21.23,25.56) v1(21.23,17.56) v1(22.03,27.96) v1(22.03,19.96) v1(22.83,22.36) v1(24.43,19.16) v1(26.83,26.36) v1(27.63,28.76) v1(40.49,39.47) v1(47.32,34.75) v1(47.32,32.25) v1(47.32,29.7) v1(47.32,28.89) v1(49.33,39.85) v1(50.25,39.88) v1(51.23,39.85) v1(51.57,8.82) v1(51.57,6.47)
+5V: length 2.8
  Top Layer w0.127: v1(1.27,29.08) 1.27,29.02 1.04,28.79 1.04,28.46 R5.1 ; R12.2 1.04,23 1.04,23.38 1.29,23.63 v1(1.29,23.64) ; v1(1.24,34.48) 0.99,34.24 R4.1
  Top Layer w0.3: v1(1.1,38.84) 1.1,39.04 0.89,39.24
  Top Layer w0.381: 1.54,19.71 1.52,19.73
  vias: v1(1.55,36.42) v1(1.62,31.04) v1(1.63,25.48) v1(1.71,20.58) v1(1.73,19.53) v1(1.92,36.93) v1(1.89,35.91) v1(2.01,30.53) v1(2.04,31.55) v1(2.1,26.05) v1(2.07,25.01) v1(2.1,20.08) v1(4.65,16.66) v1(5.1,17.06) v1(5.1,16.26) v1(13.35,37.43) v1(13.35,36.54) v1(13.35,4.41) v1(13.34,3.25) v1(14.09,37.43) v1(14.1,36.54) v1(14.16,4.41) v1(14.16,3.25)
GND: length 204.3
  Top Layer w0.127: v1(5.56,39.84) 5.56,39.84 5.56,39.34 R13.2 ; 52.62,5.68 52.52,5.58 52.21,5.58 ; 52.65,8.14 52.58,8.07 52.27,8.07 ; v1(41.46,24.79) 41.46,24.52 41.98,24 ; 30.84,26.35 31.09,26.35 31.47,25.97 32.81,25.97 33.19,25.58 ; 52.23,3.83 52.24,3.82 52.24,3.22 ; 52.28,3.22 52.6,2.9 52.74,2.9
  Top Layer w0.203: v1(42.86,16.78) 42.09,17.55 42.09,17.56 ; U7.K11 U7.L12 v1(26.83,22.36) U7.N12 ; U7.K11 U7.J12 U7.H11 ; U7.K11 U7.K10 v1(27.63,19.96) ; 47.62,16.77 48.45,16.77 ; 48.45,16.77 48.49,16.74 48.49,16.02 ; 48.45,16.77 48.47,16.77 ; U7.K7 U7.L8 ; U7.L8 v1(28.43,21.56) ; U7.L8 U7.M7 v1(29.23,23.16) v1(28.43,23.96) ; v1(42.86,18.38) 42.14,17.66 42.14,17.59 ; 48.46,25.58 48.71,25.83 v1(49.1,25.83) ; 42.91,18.39 42.89,18.4 42.09,18.4 ; v1(20.94,11.98) 20.94,12.37 21.24,12.67 21.24,13.61 ; 48.46,14.38 48.51,14.44 v1(50.09,14.44) ; U7.G10 v1(27.63,17.56) U7.E10 ; U7.P13 v1(24.43,23.16) v1(25.23,22.36) ; 42.04,13.54 42.06,13.56 v1(42.06,14.38)
  Top Layer w0.254: v1(18.86,24.8) 18.9,24.76 U7.R20 ; U1.3 4.66,31.43 U1.9 ; U7.P11 U7.N10 U7.M10 v1(28.43,22.36)
  Top Layer w0.3: 46.74,6.85 46.65,6.94 46.65,9.37 ; v1(40.28,4.28) 40.28,3.88 v1(40.49,3.66) 40.61,3.66 v1(41.02,3.26) 41.16,3.11 v1(41.16,2.62) C46.2 v1(41.66,1.97) 41.88,1.97 41.89,1.98 42.98,1.98 42.98,1.97 v1(43.22,1.97) v1(44.16,1.97) 44.45,1.97 C44.2 45.03,2.06 v1(45.35,2.38) v1(45.35,3.25) v1(45.35,3.99) v1(45.35,4.84) v1(45.35,5.68) v1(45.35,6.73) 45.35,7.33 45.1,7.59 v1(44.76,7.59) v1(43.73,7.59) v1(42.75,7.59) v1(41.73,7.59) v1(40.78,7.59) 40.28,7.08 v1(40.28,6.57) ; 41.75,7.55 41.75,7.54 41.75,6.49 ; 40.85,32.65 39.12,32.65 38.44,31.96
  Top Layer w0.381: U4.9 4.74,20.53 U4.3 ; U2.3 4.76,25.91 U2.9 ; U3.9 4.55,36.82 4.55,36.02
  Top Layer w0.4: R21.1 50.35,26.64 49.54,25.83 v1(49.1,25.83) ; U7.Y5 31.63,29.31 v1(31.51,29.43)
  Top Layer w0.7: SW1.1 50.28,37.17 50.28,37.59 SW1.2
  地1 w0.127: 34.86,21.99 34.83,21.95 30.42,21.95 ; 30.46,21.19 30.65,21.19 30.67,21.17 32.83,21.17 32.85,21.15 ; 34.82,16.37 34.8,16.35 33.87,16.35 33.86,16.34 33.58,16.34 ; 32.81,14.74 33.06,14.74 33.07,14.75 34.68,14.75 34.69,14.74 ; 32.88,18.83 32.82,18.77 32.82,18.75 ; 32.81,17.96 32.84,17.96 ; 32.81,17.96 32.81,18.18 32.82,18.2 32.82,18.75 ; 32.81,17.96 30.68,17.96 30.64,18 30.44,18 ; 32.89,18.78 32.86,18.75 32.82,18.75 ; 32.82,18.75 31.47,18.75 31.47,18.74 31.25,18.74 ; 33.64,17.15 34.7,17.15 34.72,17.17 ; 34.4,18.78 34.39,18.77 33.87,18.77 33.86,18.78 33.66,18.78 ; v1(33.23,17.56) 32.75,17.08 32.75,16.73 32.83,16.65 32.83,15.56 v1(32.43,15.16) ; 30.44,14.76 29.6,14.76 29.59,14.77 ; 32.08,16.36 32.08,16.37 31.26,16.37 ; 33.75,22.87 33.65,22.77 31.47,22.77 31.47,22.77 31.22,22.77 ; 31.2,17.15 31.47,17.15 31.47,17.15 32.04,17.15 32.07,17.12 ; 34.61,17.96 34.6,17.95 33.64,17.95 ; 35.36,19.58 35.33,19.55 34.67,19.55 34.66,19.54 34.45,19.54 ; 29.62,17.95 29.07,17.95 29.06,17.94 28.84,17.94 ; 31.28,20.35 31,20.35 30.99,20.35 30.67,20.35 30.66,20.34 30.45,20.34 ; 31.22,23.58 31.46,23.58 31.47,23.57 32.05,23.57 32.05,23.57 ; 32.05,19.55 32.03,19.57 31.47,19.57 31.46,19.58 31.23,19.58 ; 29.64,15.55 30.43,15.55 30.43,15.55
  地1 w0.254: v1(42.86,19.98) 41.29,19.98
  地2 w0.127: 33.59,16.34 33.87,16.34 33.87,16.35 34.83,16.35 34.85,16.37 ; 32.84,18.79 32.82,18.77 32.82,17.93 ; 31.25,17.19 31.45,17.19 31.47,17.17 32.01,17.17 32.04,17.14 ; 31.25,16.35 32.01,16.35 32.04,16.38 ; 34.49,18.75 34.48,18.76 33.58,18.76 ; 31.91,13.96 34.41,13.96 34.47,14.01 ; 33.62,17.96 34.71,17.96 34.72,17.97 ; 34.68,17.22 34.63,17.17 33.87,17.17 33.86,17.18 33.48,17.18 ; 34.42,19.54 34.66,19.54 34.67,19.55 35.59,19.55 35.64,19.6 ; 32.87,15.54 33.06,15.54 33.07,15.55 34.78,15.55 34.8,15.52 ; 34.71,14.72 34.65,14.77 32.84,14.77
  地2 w0.254: v1(42.86,19.98) 41.16,19.98
  Bottom Layer w0.127: C15.1 32.66,13.17 32.27,13.17 32.04,13.4 32.04,13.72 32.27,13.95 32.71,13.95 32.84,14.08 ; 42.01,21.43 42.46,20.99 42.46,20.35 42.87,19.93 ; 25.76,18.36 25.76,18.3 25.42,17.97 24.99,17.97 24.84,17.81 24.84,17.63 24.69,17.48 24.69,16.91 ; 6.38,11.63 5.86,11.1 5.86,11.03 ; 32.49,15.13 32.49,15.02 32.84,14.67 32.84,14.08 ; 32.6,16.75 32.95,16.75 33.18,16.98 33.18,17.51 v1(33.23,17.56) ; 6.58,11.72 6.58,11.97 6.61,11.99 6.61,12.12 6.52,12.21 6.38,12.21 5.89,12.7 ; 5.93,10.21 5.93,10.13 5.87,10.07 5.87,9.48 5.93,9.42 5.88,9.36
  Bottom Layer w0.152: 49.1,22.39 49.1,22.38 v1(48.46,22.38) ; v1(20.43,19.16) 21.14,18.45 21.25,18.45 ; v1(22.83,18.36) 21.35,18.36 C62.1 ; v1(23.63,20.76) 23.63,21.42 23.48,21.57 ; v1(29.23,19.96) 29.23,19.53 C74.1 ; C48.2 25.23,19.12 v1(25.23,19.16)
  Bottom Layer w0.203: v1(19.63,16.76) 19.56,16.69 C60.1 ; v1(18.3,27.02) 18.56,27.27 C58.1 ; R33.1 28.43,15.92 v1(28.43,15.16) ; v1(30.03,17.56) 30.47,17.12 30.47,16.72 ; v1(28.43,21.56) 28.43,21.28 28.82,20.89 ; v1(22.03,23.96) 21.35,24.64 C63.1
  Bottom Layer w0.254: 27.3,23.16 26.76,23.69 26.76,24.03 v1(26.03,24.76) ; 26.95,15.04 26.95,14.48 v1(26.83,14.36) ; 44.9,39.1 45.05,38.95 v1(45.91,38.95) ; v1(30.03,25.56) 30.05,25.55 30.05,24.78 ; v1(29.23,24.76) 29.94,24.76 29.98,24.8 30.03,24.74 v1(30.03,23.96)
  Bottom Layer w0.3: 26.76,20.79 26.11,20.79 26.07,20.76 ; C81.2 C80.2 45.23,36.16 46.01,36.94 v1(46.01,37.2) 45.91,37.29 v1(45.91,38.95) 45.91,39.92 45.44,40.4 42.1,40.4 41.35,39.65 41.35,35.23 41.57,35.02 43.44,35.02 ; 25.22,22.35 25.22,22.87
  Bottom Layer w0.381: v1(29.31,39.12) v1(29.31,38.3) v1(29.31,37.57) v1(29.31,36.91) CN1.20 ; 22.11,39.12 v1(22.11,38.56) v1(22.11,37.58) v1(22.11,34.72) ; CN2.19 CN2.20 ; 22.11,6.1 v1(22.11,1.7) ; CN2.55 v1(14.91,1.7)
  Bottom Layer w0.4: 36.51,34.72 36.51,33.62 NOREF.1 ; v1(14.91,35.36) v1(14.91,36.53) v1(14.91,37.49) v1(14.91,39.12) ; C43.2 v1(50.91,20.57) C37.2 49.74,20.57 R26.2 ; C59.1 18.75,22.38 v1(17.92,23.21) ; v1(43.01,29.7) 43.86,29.7 C82.1 ; v1(25.23,20.76) 26,20.76 ; 27.03,21 C71.1 ; C65.1 31.51,29.22 v1(31.51,29.43)
  vias: v1(0.7,14.53) v1(2.22,12.2) v1(2.21,11.14) v1(3.59,37.46) v1(3.59,36.82) v1(3.7,32.07) v1(3.7,31.44) v1(3.8,26.55) v1(3.8,25.91) v1(3.78,21.17) v1(3.78,20.54) v1(4.22,37.46) v1(4.22,36.82) v1(4.34,34.81) v1(4.34,32.07) v1(4.34,31.44) v1(4.42,21.17) v1(4.42,20.54) v1(4.44,26.55) v1(4.44,25.91) v1(4.58,29.43) v1(4.72,34) v1(4.72,28.67) v1(4.86,37.46) v1(4.86,36.82) v1(4.97,32.07) v1(4.97,31.44) v1(4.97,18.76) v1(5.07,26.55) v1(5.07,25.91) v1(5.05,21.17) v1(5.05,20.54) v1(5.48,29.43) v1(5.86,18.51) v1(8.27,23.72) v1(8.78,34.51) v1(9.13,17.87) v1(10.35,23.03) v1(10.56,21.48) v1(10.71,32.79) v1(10.69,32.04) v1(10.68,27.85) v1(10.74,27.04) v1(10.75,26.41) v1(10.79,22.23) v1(11.27,21.43) v1(11.45,37.99) v1(11.44,32.02) v1(11.56,32.79) v1(11.54,23.06) v1(11.54,22.13) v1(11.69,27.83) v1(11.72,27.12) v1(11.72,26.49) v1(12.41,27.16) v1(12.49,27.83) v1(12.52,26.44) v1(14.89,6.08) v1(14.91,1.03) v1(20.43,27.16) v1(21.23,21.56) v1(22.03,15.96) v1(22.11,39.32) v1(22.11,3.41) v1(22.11,1.1) v1(22.83,26.36) v1(23.63,28.76) v1(24.43,15.16) v1(25.25,25.56) v1(26.03,27.96) v1(26.03,18.36) v1(28.43,27.16) v1(28.43,19.16) v1(29.23,13.56) v1(29.32,4.61) v1(29.33,3.82) v1(29.33,3.03) v1(30.03,19.16) v1(30.83,26.36) v1(31.63,20.76) v1(32.43,23.16) v1(32.51,37.2) v1(34.01,37.2) v1(34.03,27.96) v1(34.03,19.96) v1(34.83,22.36) v1(34.84,14.26) v1(35.51,28.2) v1(36.5,39.91) v1(36.5,39.27) v1(36.51,38.17) v1(36.51,6.86) v1(36.51,6.1) v1(36.51,5.37) v1(36.51,2.46) v1(36.51,1.69) v1(36.51,0.94) v1(37.13,28.08) v1(38.12,2.51) v1(38.12,1.74) v1(38.12,0.86) v1(39.49,2.51) v1(39.49,1.74) v1(39.53,0.86) v1(40.01,28.2) v1(41.35,37.38) v1(41.51,28.2) v1(41.84,40.13) v1(42.06,25.58) v1(42.06,22.38) v1(42.06,17.58) v1(42.06,13.58) v1(42.52,40.41) v1(42.86,15.98) v1(43.01,28.2) v1(43.46,35.02) v1(43.7,40.41) v1(44.51,28.2) v1(44.72,40.41) v1(45.07,35.6) v1(45.67,40.16) v1(45.75,36.65) v1(46,38.12) v1(46.01,28.2) v1(46.62,6.4) v1(46.62,5.39) v1(46.62,4.28) v1(46.86,14.38) v1(47.13,5.89) v1(47.13,4.88) v1(47.66,19.98) v1(48.46,23.98) v1(48.46,18.38) v1(48.46,16.78) v1(49.23,37.35) v1(49.67,16.01) v1(49.8,6.52) v1(49.8,5.51) v1(49.8,4.41) v1(50.25,37.34) v1(50.29,7.14) v1(50.29,6.13) v1(50.29,5.03) v1(50.51,25.2) v1(50.51,23.7) v1(50.51,22.2) v1(50.51,16.2) v1(51.36,37.35) v1(52.66,8.14) v1(52.64,5.65) v1(52.72,2.86)
(no net): length 0.7
  Bottom Layer w0.152: 34.11,34.72 34.11,34.73 34.11,35.4
AIO_1_N: length 14.1
  Top Layer w0.127: v1(27.63,25.56) 28.03,25.96 28.6,25.96 28.83,26.19 28.83,29.03 29.11,29.3 29.11,29.66 29.72,30.26 30.73,30.26 32,31.54 32,31.91 arc(31.94,32.05) 31.81,32.1 31.5,32.1 arc(31.31,32.29) 31.5,32.48 31.81,32.48 arc(32,32.68) 31.81,32.87 31.5,32.87 arc(31.31,33.06) 31.5,33.25 31.81,33.25 arc(31.94,33.3) 32,33.44 32,34.03 31.72,34.31 v1(31.72,34.74)
AIO_1_P: length 14.2
  Top Layer w0.127: v1(32.47,34.73) 32.47,34.25 32.25,34.03 32.25,31.43 30.83,30.01 29.82,30.01 29.37,29.55 29.37,29.26 29.63,29 29.63,26.14 29.45,25.97 29.04,25.97 28.82,25.75 28.82,25.34 28.64,25.15 27.24,25.15 v1(26.83,25.56)
AIO_2_N: length 14.3
  Top Layer w0.127: U7.U12 26.44,26.77 27,26.77 27.23,27 27.23,29.03 27.5,29.3 27.5,29.53 28.11,30.14 arc(28.16,30.27) 28.11,30.41 27.96,30.55 arc(27.96,31.18) 28.59,31.18 28.74,31.03 arc(29,31.03) 29,31.3 28.86,31.45 arc(28.86,32.08) 29.49,32.08 29.63,31.93 arc(29.77,31.88) 29.9,31.93 30.39,32.42 30.39,32.79 arc(30.34,32.93) 30.2,32.98 30.07,32.98 arc(29.88,33.18) 30.07,33.37 30.2,33.37 arc(30.39,33.56) 30.2,33.75 30.07,33.75 arc(29.88,33.94) 30.07,34.13 30.2,34.13 arc(30.34,34.18) 30.39,34.32 30.39,34.46 v1(30.13,34.73)
AIO_2_P: length 14.2
  Top Layer w0.127: U7.T12 26.44,25.96 26.99,25.96 27.23,26.21 27.23,26.51 27.49,26.77 27.87,26.77 28.02,26.93 28.02,29.02 27.78,29.27 27.78,29.45 28.29,29.96 arc(28.42,30.27) 28.29,30.58 28.14,30.73 arc(28.14,31) 28.41,31 28.56,30.85 arc(29.18,30.85) 29.18,31.48 29.04,31.63 arc(29.04,31.9) 29.31,31.9 29.45,31.75 arc(29.77,31.62) 30.08,31.75 30.65,32.32 30.65,34.45 v1(30.92,34.73)
AIO_3_N: length 14.3
  Bottom Layer w0.127: v1(25.23,27.16) 25.43,26.96 26.55,26.96 26.94,27.35 arc(26.99,27.48) 26.94,27.62 26.9,27.65 arc(26.9,27.92) 27.17,27.92 27.2,27.89 arc(27.34,27.83) 27.47,27.89 28.55,28.96 28.55,29.52 arc(28.68,29.84) 28.99,29.97 29.48,29.97 arc(29.67,30.16) 29.48,30.35 28.99,30.35 arc(28.55,30.79) 28.99,31.24 29.48,31.24 arc(29.67,31.43) 29.48,31.62 28.99,31.62 arc(28.68,31.75) 28.55,32.06 28.55,32.33 27.98,32.9 27.98,33.32 27.71,33.6 CN1.24
AIO_3_P: length 14.2
  Bottom Layer w0.127: v1(25.23,26.36) 25.58,26.71 26.65,26.71 28.8,28.86 28.8,29.52 arc(28.86,29.66) 28.99,29.71 29.48,29.71 arc(29.92,30.16) 29.48,30.6 28.99,30.6 arc(28.8,30.79) 28.99,30.98 29.48,30.98 arc(29.92,31.43) 29.48,31.87 28.99,31.87 arc(28.86,31.93) 28.8,32.06 28.8,32.44 28.23,33 28.23,33.32 28.51,33.6 28.51,34.72
AIO_4_N: length 14.2
  Top Layer w0.127: U7.W13 25.63,28.36 25.63,29.06 25.9,29.33 25.9,30.98 29.16,34.24 29.16,34.44 arc(29.1,34.57) 28.96,34.63 28.78,34.63 arc(28.59,34.82) 28.78,35.01 28.96,35.01 arc(29.1,35.06) 29.16,35.2 29.16,35.73 30.38,36.95 30.38,37.38 v1(30.16,37.6)
  Bottom Layer w0.127: 30.11,39.12 30.16,39.08 v1(30.16,37.6)
AIO_4_P: length 14.2
  Top Layer w0.127: v1(30.9,37.6) 30.63,37.33 30.63,36.85 29.41,35.62 29.41,34.13 26.15,30.88 26.15,29.33 26.43,29.05 26.43,27.56 U7.V12
  Bottom Layer w0.127: v1(30.9,37.6) 30.9,39.11 CN1.15
AIO_5_N: length 14.2
  Top Layer w0.127: v1(24.54,35.3) 24.54,35.21 23.49,34.17 23.49,33.32 arc(23.44,33.19) 23.3,33.13 22.56,33.13 arc(22.11,32.69) 22.56,32.24 23.3,32.24 arc(23.49,32.05) 23.3,31.86 22.9,31.86 arc(22.46,31.42) 22.9,30.97 23.3,30.97 arc(23.44,30.92) 23.49,30.78 23.49,29.45 23.24,29.19 23.24,25.96 U7.T15
AIO_5_P: length 14.4
  Top Layer w0.127: v1(25.27,34.81) 24.5,34.81 23.75,34.06 23.75,33.32 arc(23.62,33.01) 23.3,32.88 22.56,32.88 arc(22.37,32.69) 22.56,32.5 23.3,32.5 arc(23.75,32.05) 23.3,31.61 22.9,31.61 arc(22.71,31.42) 22.9,31.23 23.3,31.23 arc(23.62,31.1) 23.75,30.78 23.75,29.36 24.04,29.06 24.04,25.95 U7.T14
AIO_6_N: length 14.3
  Bottom Layer w0.127: v1(24.43,24.76) 24.59,24.91 24.59,27.58 26.38,29.38 26.38,29.93 arc(26.51,30.24) 26.83,30.37 27.02,30.37 arc(27.21,30.56) 27.02,30.76 26,30.76 arc(25.56,31.2) 26,31.64 26.19,31.64 arc(26.33,31.7) 26.38,31.83 26.38,32.25 arc(26.33,32.38) 26.19,32.44 25.95,32.44 arc(25.76,32.63) 25.95,32.82 26.19,32.82 arc(26.33,32.87) 26.38,33.01 26.38,33.32 26.11,33.6 26.11,34.72
AIO_6_P: length 14.3
  Bottom Layer w0.127: CN1.26 26.91,33.6 26.63,33.32 26.63,31.83 arc(26.5,31.52) 26.19,31.39 26,31.39 arc(25.81,31.2) 26,31.01 27.02,31.01 arc(27.46,30.56) 27.02,30.12 26.83,30.12 arc(26.69,30.06) 26.63,29.93 26.63,29.27 24.84,27.48 24.84,24.59 24.43,24.19 v1(24.43,23.96)
AIO_7_N: length 14.2
  Top Layer w0.127: v1(19.09,37.84) 19.09,37.62 19.19,37.52 19.19,36.28 arc(19.32,35.97) 19.64,35.84 20.43,35.84 arc(20.62,35.65) 20.43,35.46 19.64,35.46 arc(19.32,35.33) 19.19,35.01 19.19,33.34 22.31,30.23 22.31,29.03 U7.Y17
  Bottom Layer w0.127: v1(19.09,37.84) 19.09,39.06 19.19,39.17
AIO_7_P: length 14.3
  Top Layer w0.127: v1(19.7,37.83) 19.7,37.77 19.45,37.52 19.45,36.28 arc(19.5,36.15) 19.64,36.09 20.43,36.09 arc(20.87,35.65) 20.43,35.2 19.64,35.2 arc(19.5,35.15) 19.45,35.01 19.45,33.45 22.56,30.34 22.56,29.03 U7.Y16
  Bottom Layer w0.127: v1(19.7,37.83) 19.7,38.91 19.45,39.17
AIO_8_N: length 14.2
  Top Layer w0.127: v1(26.15,37.58) 26.39,37.34 26.39,35.12 arc(26.52,34.8) 26.84,34.67 27.47,34.67 arc(27.66,34.48) 27.47,34.29 26.84,34.29 arc(26.52,34.16) 26.39,33.85 26.39,32.55 26.04,32.2 arc(25.9,32.14) 25.77,32.2 25.75,32.22 arc(25.48,32.22) 25.48,31.95 25.5,31.93 arc(25.5,31.66) 25.23,31.66 25.21,31.68 arc(24.94,31.68) 24.94,31.41 24.96,31.39 arc(25.02,31.26) 24.96,31.12 24.5,30.66 24.5,29.68 24.43,29.61 U7.Y14
  Bottom Layer w0.127: 26.11,39.12 26.15,39.08 v1(26.15,37.58)
AIO_8_P: length 14.2
  Top Layer w0.127: U7.W14 24.83,28.35 24.83,29.61 24.76,29.68 24.76,30.56 26.65,32.45 26.65,33.85 arc(26.7,33.98) 26.84,34.04 27.47,34.04 arc(27.91,34.48) 27.47,34.93 26.84,34.93 arc(26.7,34.98) 26.65,35.12 26.65,37.34 v1(26.88,37.57)
  Bottom Layer w0.127: CN1.25 26.88,39.1 v1(26.88,37.57)
AIO_9_N:
  vias: v1(22.03,26.36)
AIO_9_P: length 22.6
  信号 w0.127: v1(22.83,25.56) 24.37,25.56 24.78,25.97 25.56,25.97 29.23,29.63 29.23,29.99 v1(30.69,31.45)
  Bottom Layer w0.127: v1(41.16,29.68) 40.15,28.67 35.96,28.67 35.64,28.99 33.15,28.99 v1(30.69,31.45)
AIO_10_N: length 15
  信号 w0.152: v1(27.8,37.29) 27.99,37.1 27.99,36.07 26.98,35.06 26.98,33.92 25.91,32.85 arc(25.74,32.78) 25.56,32.85 25.53,32.88 arc(25.18,32.88) 25.18,32.52 25.21,32.5 arc(25.28,32.32) 25.21,32.14 24.53,31.46 24.53,30.54 arc(24.68,30.17) 25.06,30.02 25.09,30.02 arc(25.34,29.77) 25.09,29.52 25.06,29.52 arc(24.68,29.36) 24.53,28.99 24.53,28.41 24.02,27.91 23.8,27.91 23.75,27.96 v1(23.63,27.96)
  Bottom Layer w0.203: CN1.23 27.71,37.84 27.8,37.75 v1(27.8,37.29)
AIO_10_P: length 15
  信号 w0.152: v1(28.47,37.29) 28.27,37.09 28.27,35.96 27.26,34.95 27.26,33.8 24.81,31.35 24.81,30.54 arc(24.88,30.37) 25.06,30.29 25.09,30.29 arc(25.62,29.77) 25.09,29.24 25.06,29.24 arc(24.88,29.16) 24.81,28.99 24.81,28.3 23.67,27.16 v1(23.63,27.16)
  Bottom Layer w0.203: v1(28.47,37.29) 28.47,37.78 28.51,37.82 28.51,39.12
AIO_12_N: length 14
  Bottom Layer w0.127: CN1.46 18.91,33.6 19.17,33.33 19.17,32.99 arc(19.11,32.86) 18.98,32.8 18.81,32.8 arc(18.37,32.36) 18.81,31.91 19.78,31.91 arc(19.97,31.72) 19.78,31.53 18.81,31.53 arc(18.37,31.09) 18.81,30.64 19.78,30.64 arc(19.97,30.45) 19.78,30.26 19.62,30.26 arc(19.3,30.13) 19.17,29.82 19.17,29.47 20.04,28.61 20.04,26.93 20.43,26.54 v1(20.43,26.36)
AIO_12_P: length 14.3
  Bottom Layer w0.127: v1(21.23,26.36) 20.83,26.76 20.83,28.17 19.42,29.58 19.42,29.82 arc(19.48,29.95) 19.62,30.01 19.78,30.01 arc(20.23,30.45) 19.78,30.9 18.81,30.9 arc(18.62,31.09) 18.81,31.28 19.78,31.28 arc(20.23,31.72) 19.78,32.17 18.81,32.17 arc(18.62,32.36) 18.81,32.55 18.98,32.55 arc(19.29,32.68) 19.42,32.99 19.42,33.31 19.71,33.6 CN1.44
AIO_14_N: length 14.2
  Bottom Layer w0.127: 19.63,23.91 19.63,24.61 17.56,26.69 17.56,29.04 arc(17.5,29.17) 17.37,29.23 17.07,29.23 arc(16.88,29.42) 17.07,29.61 17.37,29.61 arc(17.5,29.67) 17.56,29.8 17.56,31.21 ; 17.3,34.67 17.3,33.44 17.56,33.19 17.56,32.48 arc(17.5,32.34) 17.37,32.29 16.99,32.29 arc(16.54,31.84) 16.99,31.4 17.37,31.4 arc(17.5,31.34) 17.56,31.21
  vias: v1(19.63,23.96)
AIO_14_P: length 14.3
  Bottom Layer w0.127: v1(19.63,23.16) 20.05,23.58 20.05,24.56 17.81,26.8 17.81,31.21 ; 18.11,34.72 18.11,33.5 17.81,33.21 17.81,32.48 arc(17.68,32.16) 17.37,32.03 16.99,32.03 arc(16.8,31.84) 16.99,31.65 17.37,31.65 arc(17.68,31.52) 17.81,31.21
AIO_15_N: length 14.1
  信号 w0.127: v1(17.31,38.94) 17.32,38.95 18.22,38.95 18.52,38.65 18.52,37.82 18.99,37.34 18.99,26.93 19.57,26.36 v1(19.63,26.36)
AIO_15_P: length 14.2
  信号 w0.127: v1(19.63,25.56) 19.63,25.62 18.74,26.51 18.74,31.65 arc(18.68,31.79) 18.55,31.84 18.42,31.84 arc(18.23,32.03) 18.42,32.22 18.55,32.22 arc(18.68,32.28) 18.74,32.41 18.74,37.12 18.09,37.77 18.09,38.45
  vias: v1(18.09,38.36)
AIO_16_N: length 14.2
  Top Layer w0.127: v1(15.7,33.98) 15.98,33.71 15.98,32.9 16.87,32.01 16.87,31.74 arc(17,31.43) 17.31,31.3 19.05,31.3 arc(19.24,31.1) 19.05,30.91 17.31,30.91 arc(17,30.78) 16.87,30.47 16.87,29.22 17.28,28.81 arc(17.33,28.67) 17.28,28.54 17.21,28.47 arc(17.21,28.2) 17.48,28.2 17.55,28.27 arc(17.82,28.27) 17.82,28 17.75,27.93 arc(17.75,27.66) 18.01,27.66 18.09,27.73 arc(18.22,27.78) 18.36,27.73 18.4,27.69 19.03,27.69 19.31,27.96 U7.W20
AIO_16_P: length 14.2
  Top Layer w0.127: v1(16.5,33.98) 16.23,33.71 16.23,33.01 17.12,32.12 17.12,31.74 arc(17.18,31.6) 17.31,31.55 19.05,31.55 arc(19.5,31.1) 19.05,30.66 17.31,30.66 arc(17.18,30.6) 17.12,30.47 17.12,29.32 18.5,27.94 18.93,27.94 19.2,28.21 19.21,28.21 19.35,28.36 19.81,28.36 20.04,28.12 20.04,27.57 U7.V20
AIO_17_N: length 14.3
  Top Layer w0.127: U7.Y19 20.71,29.03 20.71,30.78 18.42,33.06 arc(18.29,33.11) 18.15,33.06 17.81,32.72 arc(17.18,32.72) 17.18,33.35 17.53,33.69 arc(17.58,33.82) 17.53,33.96 16.05,35.43 16.05,37.47 v1(15.8,37.72)
  Bottom Layer w0.127: CN1.53 15.84,38.99 15.84,37.76 v1(15.8,37.72)
